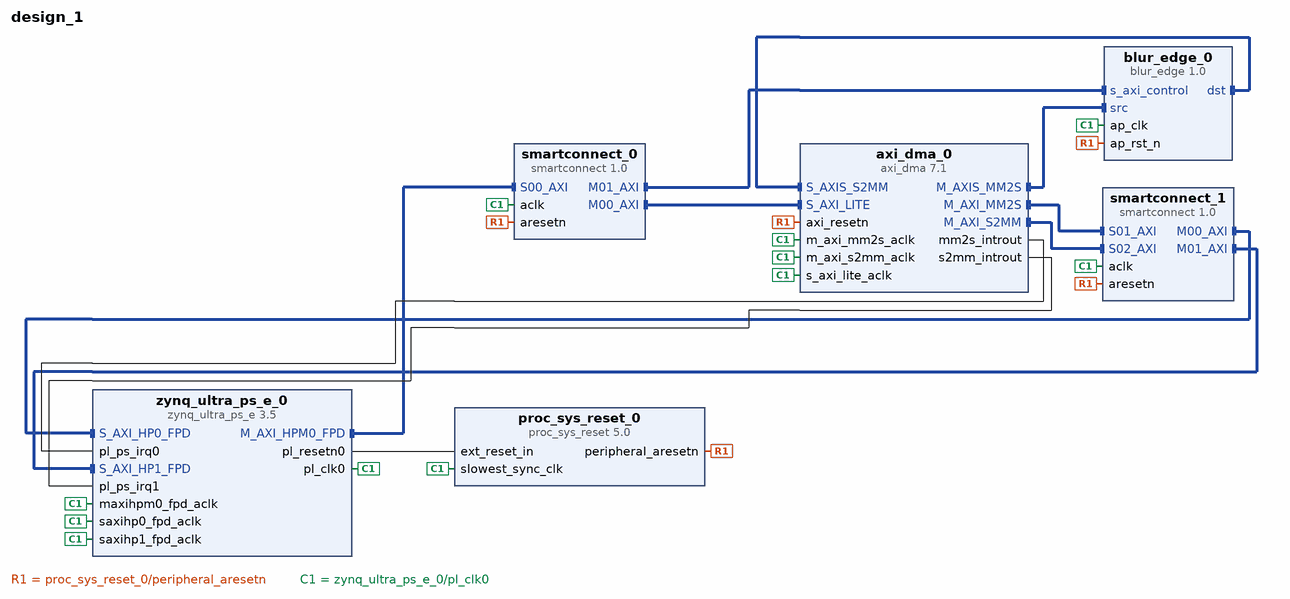
[diagram p0: block diagram of the top level]
# Vivado block design design_1, xczu3eg-sfvc784-2-e, Vivado 2024.1
create_bd_design design_1

create_bd_cell -type ip -vlnv xilinx.com:ip:zynq_ultra_ps_e:3.5 zynq_ultra_ps_e_0
set_property -dict [list \
  CONFIG.PSU__DDR_HIGH_ADDRESS_GUI_ENABLE 0 \
  CONFIG.PSU__MAXIGP0__DATA_WIDTH 128 \
  CONFIG.PSU__USE__IRQ0 1 \
  CONFIG.PSU__USE__IRQ1 1 \
  CONFIG.PSU__USE__M_AXI_GP0 1 \
  CONFIG.PSU__USE__M_AXI_GP2 0 \
  CONFIG.PSU__USE__S_AXI_GP2 1 \
  CONFIG.PSU__USE__S_AXI_GP3 1 \
] [get_bd_cells zynq_ultra_ps_e_0]
# 6 more settings of zynq_ultra_ps_e_0 are not shown: defaults, MIO pin electricals, DDR timing, and values the tool derives
create_bd_cell -type ip -vlnv xilinx.com:ip:proc_sys_reset:5.0 proc_sys_reset_0
create_bd_cell -type ip -vlnv xilinx.com:ip:smartconnect:1.0 smartconnect_0
set_property -dict {CONFIG.NUM_MI 2 CONFIG.NUM_SI 1} [get_bd_cells smartconnect_0]
create_bd_cell -type ip -vlnv xilinx.com:ip:smartconnect:1.0 smartconnect_1
set_property -dict {CONFIG.NUM_MI 2 CONFIG.NUM_SI 3} [get_bd_cells smartconnect_1]
create_bd_cell -type ip -vlnv xilinx.com:ip:axi_dma:7.1 axi_dma_0
set_property -dict {CONFIG.c_include_sg 0 CONFIG.c_m_axis_mm2s_tdata_width 8 CONFIG.c_sg_length_width 19} [get_bd_cells axi_dma_0]
create_bd_cell -type ip -vlnv xilinx.com:hls:blur_edge:1.0 blur_edge_0

# ---- connections ----

connect_bd_intf_net [get_bd_intf_pins blur_edge_0/src] [get_bd_intf_pins axi_dma_0/M_AXIS_MM2S]
connect_bd_intf_net [get_bd_intf_pins axi_dma_0/M_AXI_MM2S] [get_bd_intf_pins smartconnect_1/S01_AXI]
connect_bd_intf_net [get_bd_intf_pins axi_dma_0/M_AXI_S2MM] [get_bd_intf_pins smartconnect_1/S02_AXI]
connect_bd_intf_net [get_bd_intf_pins blur_edge_0/dst] [get_bd_intf_pins axi_dma_0/S_AXIS_S2MM]
connect_bd_intf_net [get_bd_intf_pins axi_dma_0/S_AXI_LITE] [get_bd_intf_pins smartconnect_0/M00_AXI]
connect_bd_intf_net [get_bd_intf_pins smartconnect_0/M01_AXI] [get_bd_intf_pins blur_edge_0/s_axi_control]
connect_bd_intf_net [get_bd_intf_pins zynq_ultra_ps_e_0/S_AXI_HP0_FPD] [get_bd_intf_pins smartconnect_1/M00_AXI]
connect_bd_intf_net [get_bd_intf_pins smartconnect_1/M01_AXI] [get_bd_intf_pins zynq_ultra_ps_e_0/S_AXI_HP1_FPD]
connect_bd_intf_net [get_bd_intf_pins zynq_ultra_ps_e_0/M_AXI_HPM0_FPD] [get_bd_intf_pins smartconnect_0/S00_AXI]
connect_bd_net [get_bd_pins axi_dma_0/mm2s_introut] [get_bd_pins zynq_ultra_ps_e_0/pl_ps_irq0]
connect_bd_net [get_bd_pins axi_dma_0/s2mm_introut] [get_bd_pins zynq_ultra_ps_e_0/pl_ps_irq1]
connect_bd_net [get_bd_pins proc_sys_reset_0/peripheral_aresetn] \
  [get_bd_pins axi_dma_0/axi_resetn] [get_bd_pins blur_edge_0/ap_rst_n] [get_bd_pins smartconnect_0/aresetn] \
  [get_bd_pins smartconnect_1/aresetn]
connect_bd_net [get_bd_pins zynq_ultra_ps_e_0/pl_clk0] \
  [get_bd_pins proc_sys_reset_0/slowest_sync_clk] [get_bd_pins axi_dma_0/s_axi_lite_aclk] \
  [get_bd_pins axi_dma_0/m_axi_mm2s_aclk] [get_bd_pins axi_dma_0/m_axi_s2mm_aclk] [get_bd_pins blur_edge_0/ap_clk] \
  [get_bd_pins smartconnect_1/aclk] [get_bd_pins smartconnect_0/aclk] [get_bd_pins zynq_ultra_ps_e_0/maxihpm0_fpd_aclk] \
  [get_bd_pins zynq_ultra_ps_e_0/saxihp0_fpd_aclk] [get_bd_pins zynq_ultra_ps_e_0/saxihp1_fpd_aclk]
connect_bd_net [get_bd_pins zynq_ultra_ps_e_0/pl_resetn0] [get_bd_pins proc_sys_reset_0/ext_reset_in]

# ---- address map ----
assign_bd_address -offset 0x00000000 -range 1G -target_address_space [get_bd_addr_spaces axi_dma_0/Data_MM2S] [get_bd_addr_segs zynq_ultra_ps_e_0/SAXIGP2/HP0_DDR_LOW]
assign_bd_address -offset 0x40000000 -range 1G -target_address_space [get_bd_addr_spaces axi_dma_0/Data_MM2S] [get_bd_addr_segs zynq_ultra_ps_e_0/SAXIGP3/HP1_DDR_LOW]
exclude_bd_addr_seg -offset 0xFF000000 -range 8M -target_address_space [get_bd_addr_spaces axi_dma_0/Data_MM2S] [get_bd_addr_segs zynq_ultra_ps_e_0/SAXIGP2/HP0_LPS_OCM]
exclude_bd_addr_seg -offset 0xFF800000 -range 8M -target_address_space [get_bd_addr_spaces axi_dma_0/Data_MM2S] [get_bd_addr_segs zynq_ultra_ps_e_0/SAXIGP3/HP1_LPS_OCM]
assign_bd_address -offset 0x00000000 -range 1G -target_address_space [get_bd_addr_spaces axi_dma_0/Data_S2MM] [get_bd_addr_segs zynq_ultra_ps_e_0/SAXIGP2/HP0_DDR_LOW]
assign_bd_address -offset 0x40000000 -range 1G -target_address_space [get_bd_addr_spaces axi_dma_0/Data_S2MM] [get_bd_addr_segs zynq_ultra_ps_e_0/SAXIGP3/HP1_DDR_LOW]
exclude_bd_addr_seg -offset 0xFF000000 -range 8M -target_address_space [get_bd_addr_spaces axi_dma_0/Data_S2MM] [get_bd_addr_segs zynq_ultra_ps_e_0/SAXIGP2/HP0_LPS_OCM]
exclude_bd_addr_seg -offset 0xFF800000 -range 8M -target_address_space [get_bd_addr_spaces axi_dma_0/Data_S2MM] [get_bd_addr_segs zynq_ultra_ps_e_0/SAXIGP3/HP1_LPS_OCM]
assign_bd_address -offset 0x00000000 -range 1G -target_address_space [get_bd_addr_spaces axi_dma_0/Data_SG] [get_bd_addr_segs zynq_ultra_ps_e_0/SAXIGP2/HP0_DDR_LOW]
assign_bd_address -offset 0x40000000 -range 1G -target_address_space [get_bd_addr_spaces axi_dma_0/Data_SG] [get_bd_addr_segs zynq_ultra_ps_e_0/SAXIGP3/HP1_DDR_LOW]
exclude_bd_addr_seg -offset 0xFF000000 -range 8M -target_address_space [get_bd_addr_spaces axi_dma_0/Data_SG] [get_bd_addr_segs zynq_ultra_ps_e_0/SAXIGP2/HP0_LPS_OCM]
exclude_bd_addr_seg -offset 0xFF800000 -range 8M -target_address_space [get_bd_addr_spaces axi_dma_0/Data_SG] [get_bd_addr_segs zynq_ultra_ps_e_0/SAXIGP3/HP1_LPS_OCM]
assign_bd_address -offset 0x00A0000000 -range 64K -target_address_space [get_bd_addr_spaces zynq_ultra_ps_e_0/Data] [get_bd_addr_segs axi_dma_0/S_AXI_LITE/Reg]
assign_bd_address -offset 0x00A0010000 -range 64K -target_address_space [get_bd_addr_spaces zynq_ultra_ps_e_0/Data] [get_bd_addr_segs blur_edge_0/s_axi_control/Reg]

validate_bd_design
save_bd_design
